# Altium schematic sheet hdmi.SchDoc: HDMI type C interface
size A3; Author: Olexandr Gudozhnik; Organization: EPFL-STI-LIS; Address1: EPFL, Station 9; Address2: 1015 Lausanne; Address3: Switzerland; DocumentNumber: 7; SheetNumber: 7; SheetTotal: 8
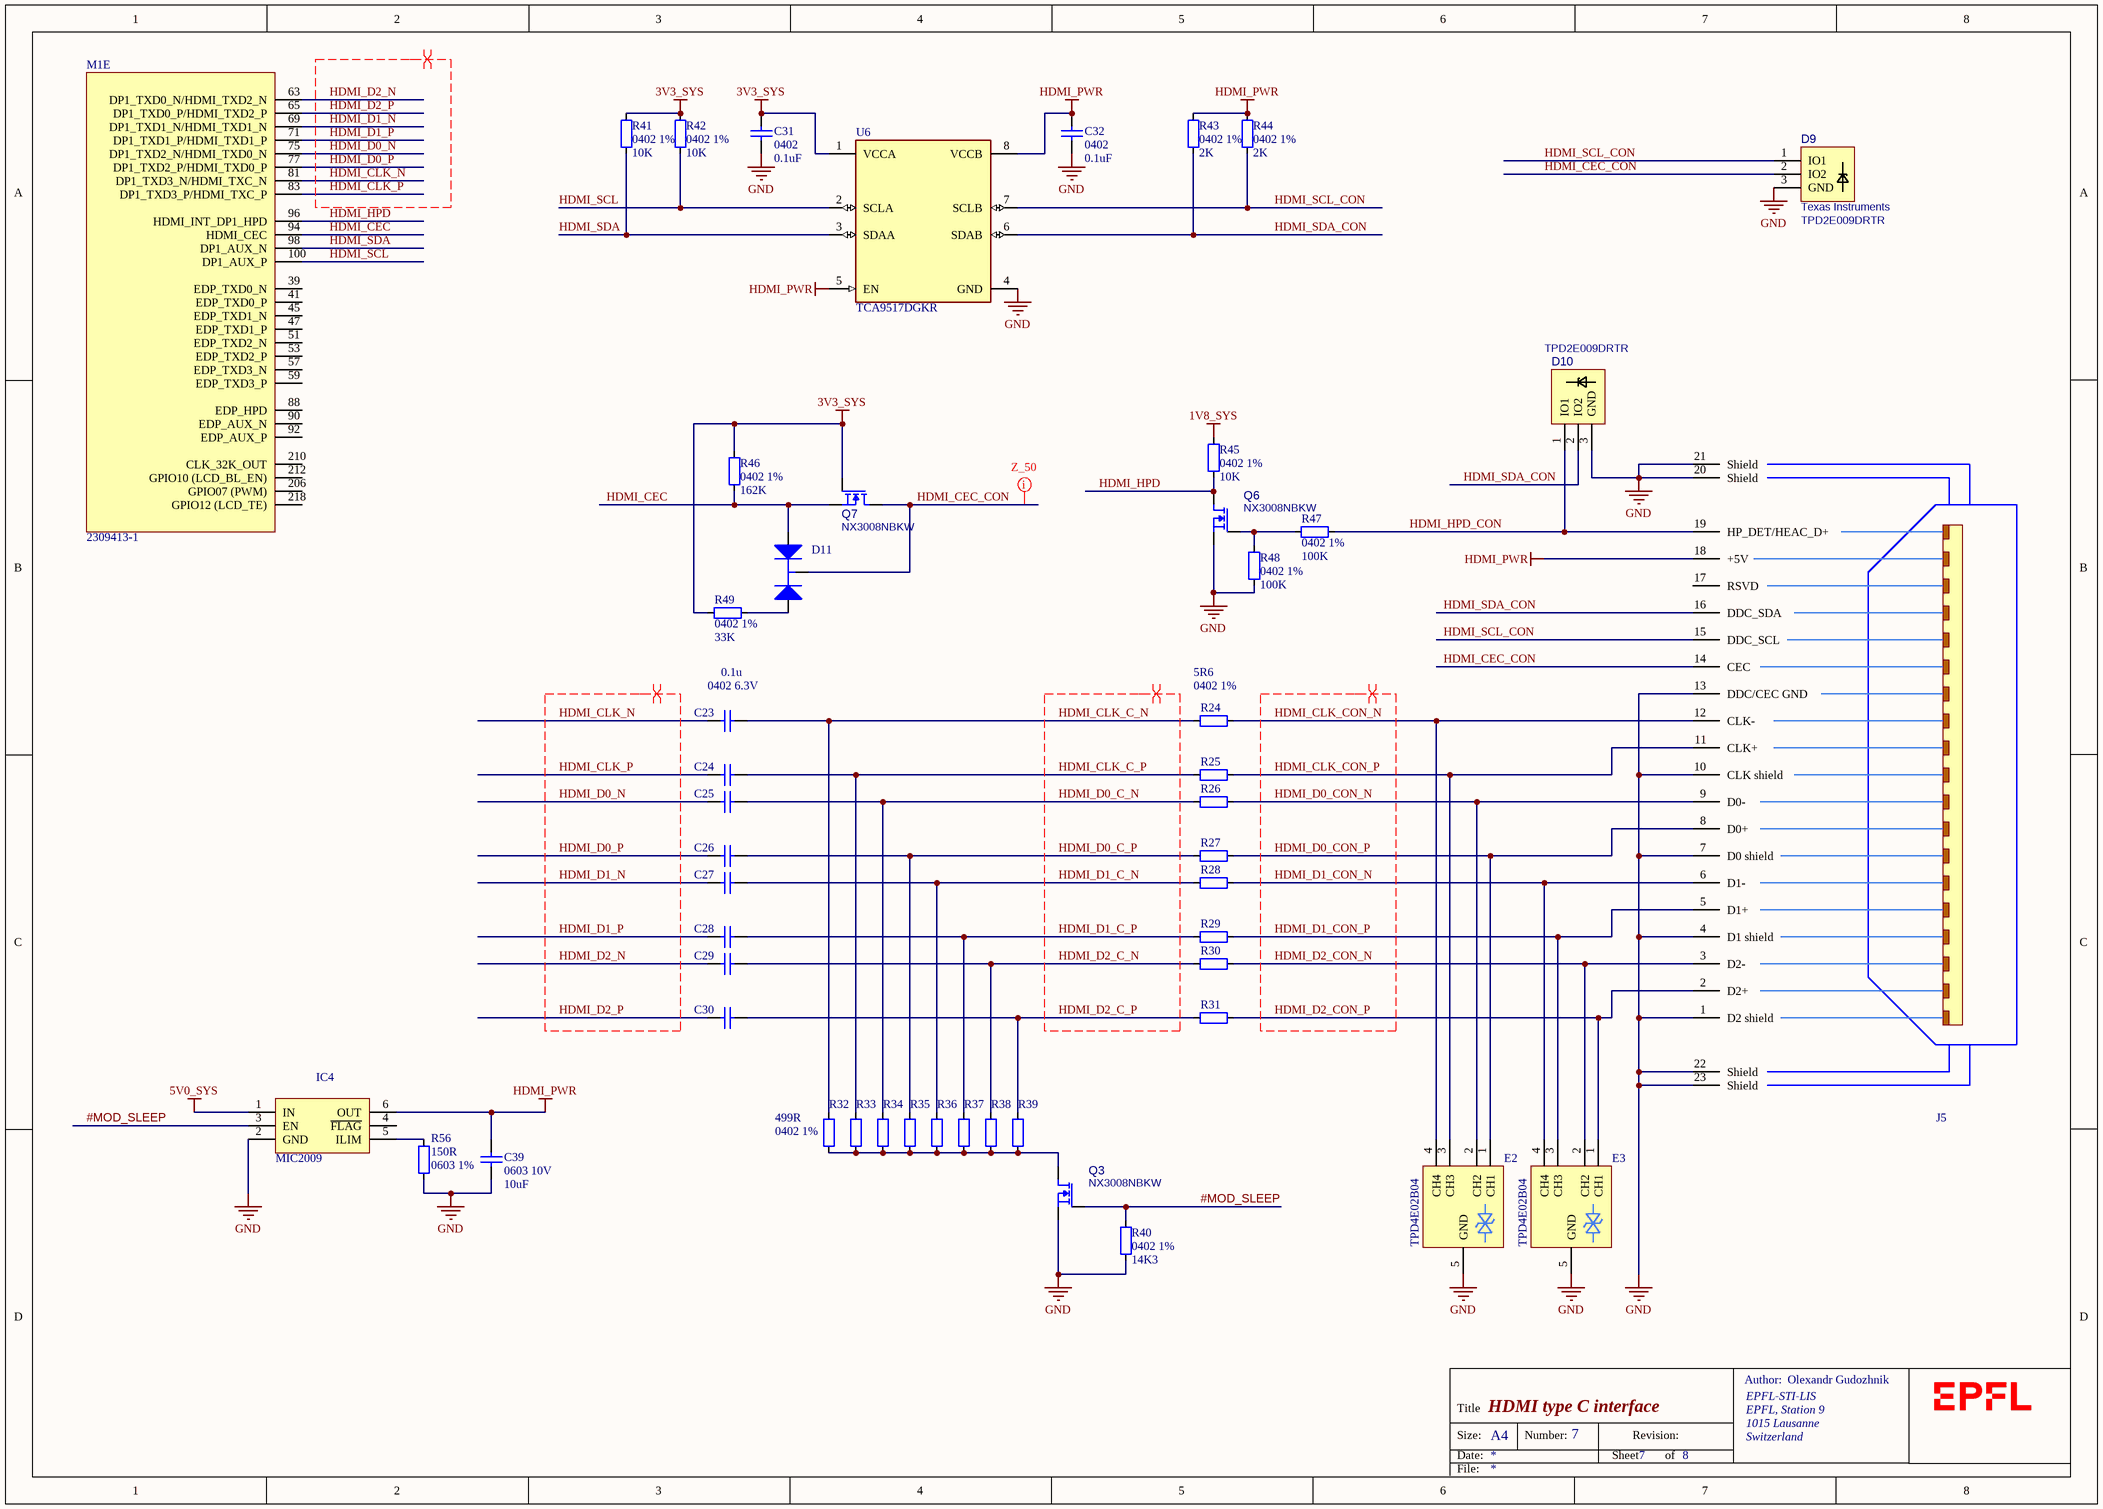
[diagram p0: hdmi.SchDoc]

## Parts
C23  0402 6.3V  value 0.1u  [cap0402_void]
C24  0402 6.3V  [cap0402_void]  (value not drawn)
C25  0402 6.3V  [cap0402_void]  (value not drawn)
C26  0402 6.3V  [cap0402_void]  (value not drawn)
C27  0402 6.3V  [cap0402_void]  (value not drawn)
C28  0402 6.3V  [cap0402_void]  (value not drawn)
C29  0402 6.3V  [cap0402_void]  (value not drawn)
C30  0402 6.3V  [cap0402_void]  (value not drawn)
C31  0402  value 0.1uF  [cap0402]
C32  0402  value 0.1uF  [cap0402]
C39  0603 10V  value 10uF  [cap0603]
D9  TPD2E009DRTR  Manufacturer: Texas Instruments  [SOT-3]
D10  TPD2E009DRTR  [SOT-3]
D11  .Value  [SC70]  (value not drawn)
E2  TPD4E02B04  [TPD4E02B04]
E3  TPD4E02B04  [TPD4E02B04]
IC4  MIC2009  [TSOP-6]
J5  HDMI_C  [mini_HDMI_WE_685119136923]  (value not drawn)
M1  2309413-1  [jetson-nano-connector]  (part E of 7)
Q3  NX3008NBKW  [SC70-3]
Q6  NX3008NBKW  [SC70-3]
Q7  NX3008NBKW  [SC70-3]
R24  0402 1%  value 5R6  [res0402_void]
R25  0402 1%  [res0402_void]  (value not drawn)
R26  0402 1%  [res0402_void]  (value not drawn)
R27  0402 1%  [res0402_void]  (value not drawn)
R28  0402 1%  [res0402_void]  (value not drawn)
R29  0402 1%  [res0402_void]  (value not drawn)
R30  0402 1%  [res0402_void]  (value not drawn)
R31  0402 1%  [res0402_void]  (value not drawn)
R32  0402 1%  value 499R  [res0402_void]
R33  0402 1%  [res0402_void]  (value not drawn)
R34  0402 1%  [res0402_void]  (value not drawn)
R35  0402 1%  [res0402_void]  (value not drawn)
R36  0402 1%  [res0402_void]  (value not drawn)
R37  0402 1%  [res0402_void]  (value not drawn)
R38  0402 1%  [res0402_void]  (value not drawn)
R39  0402 1%  [res0402_void]  (value not drawn)
R40  0402 1%  value 14K3  [res0402]
R41  0402 1%  value 10K  [res0402]
R42  0402 1%  value 10K  [res0402]
R43  0402 1%  value 2K  [res0402]
R44  0402 1%  value 2K  [res0402]
R45  0402 1%  value 10K  [res0402]
R46  0402 1%  value 162K  [res0402]
R47  0402 1%  value 100K  [res0402]
R48  0402 1%  value 100K  [res0402]
R49  0402 1%  value 33K  [res0402]
R56  0603 1%  value 150R  [res0603]
U6  TCA9517DGKR  [FP-DGK0008A-MFG]

## Nets
1V8_SYS: R45.1
3V3_SYS: C31.1 Q7.1(G) R41.1 R42.1 R46.2 R49.2 U6.1(VCCA)
5V0_SYS: IC4.1(IN)
GND: C31.2 C32.2 C39.1 D9.3(GND) D10.3(GND) E2.5(GND) E3.5(GND) IC4.2(GND) J5.1(D2_shield) J5.4(D1_shield) J5.7(D0_shield) J5.10(CLK_shield) J5.13(DDC/CEC_GND) J5.20(Shield) J5.21(Shield) J5.22(Shield) J5.23(Shield) Q3.2(S) Q6.2(S) R40.2 R48.1 R56.1 U6.4(GND)
HDMI_PWR: C32.1 C39.2 IC4.6(OUT) J5.18(+5V) R43.1 R44.1 U6.5(EN) U6.8(VCCB)
#MOD_SLEEP: IC4.3(EN) Q3.1(G) R40.1
HDMI_CEC: D11.1(A) M1.94(HDMI_CEC) Q7.2(S) R46.1
HDMI_CEC_CON: D9.2(IO2) D11.3(S) J5.14(CEC) Q7.3(D)
HDMI_CLK_C_N: C23.2 R24.1 R32.1
HDMI_CLK_C_P: C24.2 R25.1 R33.1
HDMI_CLK_CON_N: E2.4(CH4) J5.12(CLK-) R24.2
HDMI_CLK_CON_P: E2.3(CH3) J5.11(CLK+) R25.2
HDMI_CLK_N: C23.1 M1.81(DP1_TXD3_N/HDMI_TXC_N)
HDMI_CLK_P: C24.1 M1.83(DP1_TXD3_P/HDMI_TXC_P)
HDMI_D0_C_N: C25.2 R26.1 R34.1
HDMI_D0_C_P: C26.2 R27.1 R35.1
HDMI_D0_CON_N: E2.2(CH2) J5.9(D0-) R26.2
HDMI_D0_CON_P: E2.1(CH1) J5.8(D0+) R27.2
HDMI_D0_N: C25.1 M1.75(DP1_TXD2_N/HDMI_TXD0_N)
HDMI_D0_P: C26.1 M1.77(DP1_TXD2_P/HDMI_TXD0_P)
HDMI_D1_C_N: C27.2 R28.1 R36.1
HDMI_D1_C_P: C28.2 R29.1 R37.1
HDMI_D1_CON_N: E3.4(CH4) J5.6(D1-) R28.2
HDMI_D1_CON_P: E3.3(CH3) J5.5(D1+) R29.2
HDMI_D1_N: C27.1 M1.69(DP1_TXD1_N/HDMI_TXD1_N)
HDMI_D1_P: C28.1 M1.71(DP1_TXD1_P/HDMI_TXD1_P)
HDMI_D2_C_N: C29.2 R30.1 R38.1
HDMI_D2_C_P: C30.2 R31.1 R39.1
HDMI_D2_CON_N: E3.2(CH2) J5.3(D2-) R30.2
HDMI_D2_CON_P: E3.1(CH1) J5.2(D2+) R31.2
HDMI_D2_N: C29.1 M1.63(DP1_TXD0_N/HDMI_TXD2_N)
HDMI_D2_P: C30.1 M1.65(DP1_TXD0_P/HDMI_TXD2_P)
HDMI_HPD: M1.96(HDMI_INT_DP1_HPD) Q6.3(D) R45.2
HDMI_HPD_CON: D10.1(IO1) J5.19(HP_DET/HEAC_D+) R47.2
HDMI_SCL: M1.100(DP1_AUX_P) R42.2 U6.2(SCLA)
HDMI_SCL_CON: D9.1(IO1) J5.15(DDC_SCL) R44.2 U6.7(SCLB)
HDMI_SDA: M1.98(DP1_AUX_N) R41.2 U6.3(SDAA)
HDMI_SDA_CON: D10.2(IO2) J5.16(DDC_SDA) R43.2 U6.6(SDAB)
NetD11_2: D11.2(C) R49.1
NetIC4_5: IC4.5(ILIM) R56.2
NetQ3_3: Q3.3(D) R32.2 R33.2 R34.2 R35.2 R36.2 R37.2 R38.2 R39.2
NetQ6_1: Q6.1(G) R47.1 R48.2

Not connected (* = marked no-connect by the designer): IC4 4(~{FLAG}); J5 17(RSVD); M1 39(EDP_TXD0_N) 41(EDP_TXD0_P) 45(EDP_TXD1_N) 47(EDP_TXD1_P) 51(EDP_TXD2_N) 53(EDP_TXD2_P) 57(EDP_TXD3_N) 59(EDP_TXD3_P) 88(EDP_HPD) 90(EDP_AUX_N) 92(EDP_AUX_P) 206(GPIO07_(PWM)) 210(CLK_32K_OUT) 212(GPIO10_(LCD_BL_EN)) 218(GPIO12_(LCD_TE))

## Layout directives
differential pair; differential pair class DIFF100: HDMI_CLK_C_N, HDMI_CLK_C_P, HDMI_CLK_CON_N, HDMI_CLK_CON_P, HDMI_CLK_N, HDMI_CLK_P, HDMI_D0_C_N, HDMI_D0_C_P, HDMI_D0_CON_N, HDMI_D0_CON_P, HDMI_D0_N, HDMI_D0_P, HDMI_D1_C_N, HDMI_D1_C_P, HDMI_D1_CON_N, HDMI_D1_CON_P, HDMI_D1_N, HDMI_D1_P, HDMI_D2_C_N, HDMI_D2_C_P, HDMI_D2_CON_N, HDMI_D2_CON_P, HDMI_D2_N, HDMI_D2_P
rule Width Constraint [Pref Impedance = 50,00ohms    Min Impedance = 50,00ohms    Max Impedance = 50,00ohms]; net class S50: HDMI_CEC_CON

## Notes on the sheet
- Author:
- Title
- Size:
- Date:
- A4
- Number:
- Sheet
- Revision:
- of
- File:

## Library data of the parts
C23 = cap_no_param: Supplier 1: Digi-Key; Supplier Part Number 1: 490-14603-1-ND
C24-C30 = cap_no_param: Value: 0.1u; Supplier 1: Digi-Key; Supplier Part Number 1: 490-14603-1-ND
C31 C32 C39 = cap: standard, non-polarized capacitor; Supplier 1: Digi-Key; Footprint verified: no
  C31 C32: Supplier Part Number 1: 490-14603-1-ND; Supplier Price 1: 0.08
  C39: Supplier Part Number 1: 490-10474-1-ND; Supplier Price 1: 0.23
D9 = TPD2E009: ESD Suppressors 2-CH; PartNumber: TPD2E009DRTR; Value: TPD2E009DRTR; PartSymbol: TPD2E009DRTR; Supplier 1: Digi-Key; Supplier Part Number 1: 296-25410-1-ND
D10 = TPD2E009: ESD Suppressors 2-CH; Manufacturer: Texas Instruments; PartNumber: TPD2E009DRTR; Value: TPD2E009DRTR; PartSymbol: TPD2E009DRTR; Supplier 1: Digi-Key; Supplier Part Number 1: 296-25410-1-ND
D11 = diode_dual_opposite: BAT54S schottky protection; Value: BAS70W; Supplier 1: Digi-Key; Supplier Part Number 1: BAS70W-05FDICT-ND
IC4 = NCP380HSNAJAAT1G: POWER LOAD SWITCH, HIGH SIDE; Manufacturer: ON Semiconductor; Value: MIC2009; PartNumber: NCP380HSNAJAAT1G; PartSymbol: NCP380HSNAJAAT1G; Supplier 1: Digi-Key; Supplier Part Number 1: 576-1680-1-ND
M1 = 2309413-1: Memory Socket, DDR4, SODIMM Socket, 260 Contacts, Copper Alloy, Gold Plated Contacts; Manufacturer: TE CONNECTIVITY; PartNumber: 2309413-1; Value: 2309413-1; PartSymbol: 2309413-1
Q3 Q6 Q7 = NMOS: MOSFET, N CH, 60V, 0.2A; Manufacturer: NXP; PartSymbol: BSS138PW; Value: NX3008NBKW; PartNumber: NX3008NBKW; Supplier 1: Digi-Key; Supplier Part Number 1: 1727-1280-1-ND
R24 R32 R40 = res: Supplier 1: Digi-Key
  R24: Supplier Part Number 1: RMCF0402FT5R60CT-ND
  R32: Supplier Part Number 1: P499LCT-ND
  R40: Supplier Part Number 1: P14.3KLCT-ND
R25-R31 = res: Value: 5R6; Supplier 1: Digi-Key; Supplier Part Number 1: RMCF0402FT5R60CT-ND
R33-R39 = res: Value: 499R; Supplier 1: Digi-Key; Supplier Part Number 1: P499LCT-ND
R41-R49 R56 = res: 100K; Supplier 1: Digi-Key
  R41 R42 R45: Supplier Part Number 1: P10.0KLCT-ND
  R43 R44: Supplier Part Number 1: P2.00KLCT-ND
  R46: Supplier Part Number 1: P162KLCT-ND
  R47 R48: Supplier Part Number 1: P100KLCT-ND
  R49: Supplier Part Number 1: P33.0KLCT-ND
  R56: Supplier Part Number 1: 311-150HRCT-ND
U6 = CMP-04881-000001-1: IC TRNSLTR BIDIRECTIONAL 8VSSOP; Manufacturer: Texas Instruments; Sigbufrep Type: Buffer; Interface: I2C,SMBus; Min Supply Voltage: 0.9V; Max Supply Voltage: 5.5V; Standoff Height: 0.05mm; Nominal Supply Current: 1.5-3mA; Input Capacitance: 6-8pF; Number of Outputs: 2; Propagation Delay: 110ns; Output Current: 6mA; Logic Function: Translator; Turn-On Delay Time: 100ns; Max Frequency: 400kHz; Output Type: Voltage; Mouser Description: Interface - Signal Buffers, Repeaters Level-Translating I2C Bus Repeater; Manufacturer Part Number: TCA9517DGKR; Ambient Temperature Range Low: -40°C; ComponentLink2URL: http://www.ti.com/lit/ds/symlink/tca9517.pdf; Lead Free: Yes; Temperature: -40°C to +85°C; Device Class L1: Integrated Circuits (ICs); Temperature Range High: +85°C; Octopart: https://octopart.com/tca9517dgkr-texas+instruments-25896020; Ambient Temperature Range High: +85°C; Temperature Range Low: -40°C; Device Class L3: Repeaters; Device Class L2: Interface ICs; Category: IC; Height: 1.1mm; RoHS: TRUE; Automotive: No; ComponentLink2Description: Datasheet; Digikey Description: IC TRNSLTR BIDIRECTIONAL 8VSSOP; Package: DGK0008A; Ipc Land Pattern Name: SOP65P300X110-8; Supplier 1: Digi-Key; Supplier Part Number 1: 296-35972-1-ND; Stock 1: 25898; Pricing 1: 1=0,92000, 10=0,82600, 25=0,78400, 100=0,60200, 250=0,53200, 500=0,50400, 1000=0,39200 (USD); Mount: Surface Mount; Case/Package: VSSOP; Number of Pins: 8; Weight: 0.001058oz; Contact Plating: Gold,Silver; Min Operating Temperature: -40°C; Max Operating Temperature: 85°C; Packaging: Tape and Reel; Package Quantity: 2500; Number of Channels: 2; Number of Inputs: 2; Number of Bits: 2; Length: 3.1mm; Width: 3.1mm; Radiation Hardening: No; REACH SVHC: No SVHC; ComponentLink1URL: https://datasheet.ciiva.com/15395/scps242b-261267-15395636.pdf?src-supplier=Mouser; ComponentLink1Description: https://datasheet.ciiva.com/15395/scps242b-261267-15395636.pdf?src-supplier=Mouser; ComponentLink3URL: https://datasheet.ciiva.com/18613/tca9517-18613430.pdf?src-supplier=Digi-Key; ComponentLink3Description: https://datasheet.ciiva.com/18613/tca9517-18613430.pdf?src-supplier=Digi-Key; ComponentLink4URL: https://datasheet.ciiva.com/18613/tca9517-18613431.pdf?src-supplier=Digi-Key; ComponentLink4Description: https://datasheet.ciiva.com/18613/tca9517-18613431.pdf?src-supplier=Digi-Key; ComponentLink5URL: https://datasheet.ciiva.com/15047/tca9517-15047752.pdf?src-supplier=Digi-Key; ComponentLink5Description: https://datasheet.ciiva.com/15047/tca9517-15047752.pdf?src-supplier=Digi-Key; ComponentLink6URL: https://datasheet.ciiva.com/18613/tca9517-18613432.pdf?src-supplier=Digi-Key; ComponentLink6Description: https://datasheet.ciiva.com/18613/tca9517-18613432.pdf?src-supplier=Digi-Key; ComponentLink7URL: https://datasheet.ciiva.com/15222/getdatasheetpartid-728238-15222172.pdf?src-supplier=Verical; ComponentLink7Description: https://datasheet.ciiva.com/15222/getdatasheetpartid-728238-15222172.pdf?src-supplier=Verical
E2 E3 = TPD4E02B04: Supplier 1: Digi-Key; Supplier Part Number 1: 296-43875-1-ND
J5 = HDMI_C: Supplier 1: Digi-Key; Supplier Part Number 1: 732-2739-1-ND